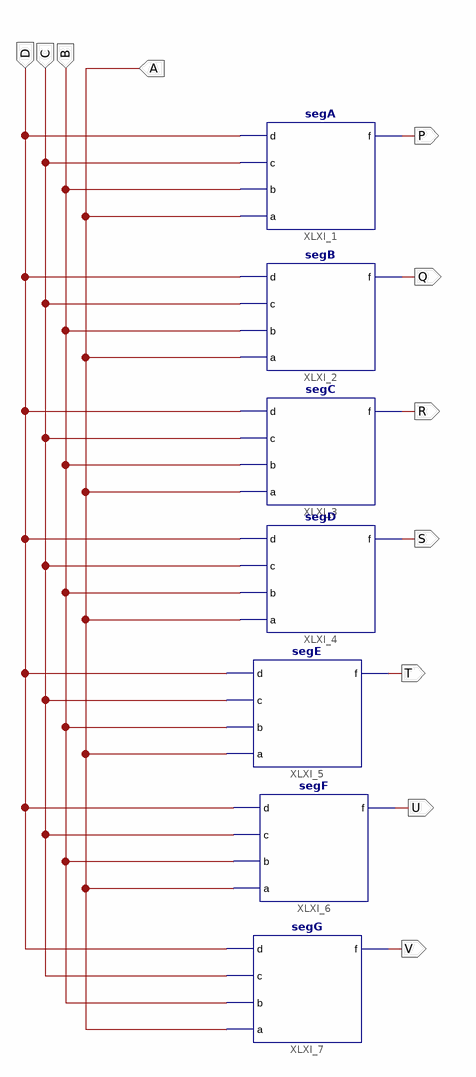
[diagram p0: schematic sheet 1]
// Xilinx ISE schematic sedmisegment.sch (spartan3e) as structural Verilog: 7 symbols, 11 ports
module sedmisegment (
  input  D,
  input  C,
  input  B,
  input  A,
  output P,
  output Q,
  output R,
  output S,
  output T,
  output U,
  output V
);

  segA XLXI_1 (.d(D), .c(C), .b(B), .a(A), .f(P));
  segB XLXI_2 (.d(D), .c(C), .b(B), .a(A), .f(Q));
  segC XLXI_3 (.d(D), .c(C), .b(B), .a(A), .f(R));
  segD XLXI_4 (.d(D), .c(C), .b(B), .a(A), .f(S));
  segE XLXI_5 (.d(D), .c(C), .b(B), .a(A), .f(T));
  segF XLXI_6 (.d(D), .c(C), .b(B), .a(A), .f(U));
  segG XLXI_7 (.d(D), .c(C), .b(B), .a(A), .f(V));
endmodule
